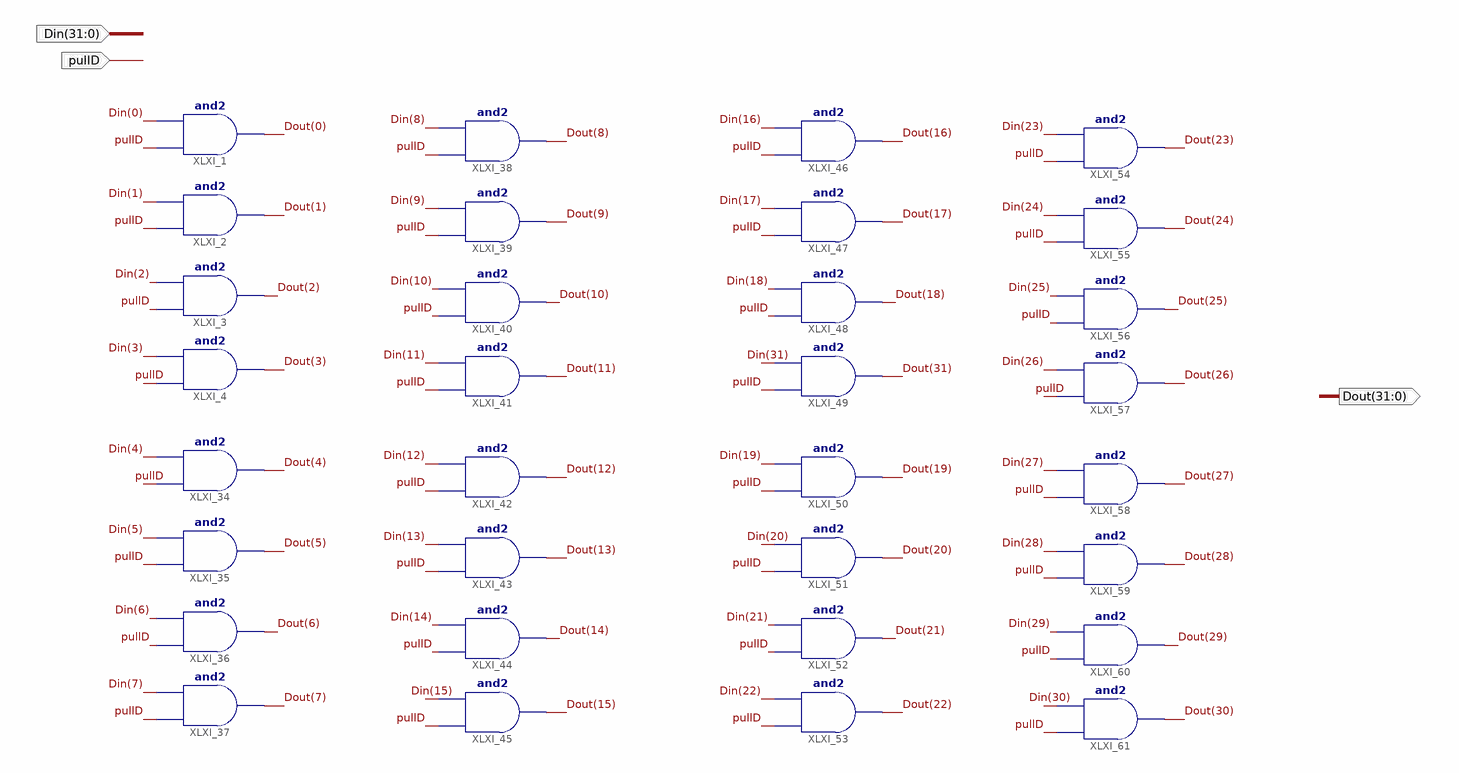
[diagram p0: schematic sheet 1]
// Xilinx ISE schematic And32with1.sch (spartan6) as structural Verilog: 32 symbols, 3 ports
module And32with1 (
  input  [31:0] Din,
  input  pullD,
  output [31:0] Dout
);

  and XLXI_1 (Dout[0], pullD, Din[0]);
  and XLXI_2 (Dout[1], pullD, Din[1]);
  and XLXI_3 (Dout[2], pullD, Din[2]);
  and XLXI_4 (Dout[3], pullD, Din[3]);
  and XLXI_34 (Dout[4], pullD, Din[4]);
  and XLXI_35 (Dout[5], pullD, Din[5]);
  and XLXI_36 (Dout[6], pullD, Din[6]);
  and XLXI_37 (Dout[7], pullD, Din[7]);
  and XLXI_38 (Dout[8], pullD, Din[8]);
  and XLXI_39 (Dout[9], pullD, Din[9]);
  and XLXI_40 (Dout[10], pullD, Din[10]);
  and XLXI_41 (Dout[11], pullD, Din[11]);
  and XLXI_42 (Dout[12], pullD, Din[12]);
  and XLXI_43 (Dout[13], pullD, Din[13]);
  and XLXI_44 (Dout[14], pullD, Din[14]);
  and XLXI_45 (Dout[15], pullD, Din[15]);
  and XLXI_46 (Dout[16], pullD, Din[16]);
  and XLXI_47 (Dout[17], pullD, Din[17]);
  and XLXI_48 (Dout[18], pullD, Din[18]);
  and XLXI_49 (Dout[31], pullD, Din[31]);
  and XLXI_50 (Dout[19], pullD, Din[19]);
  and XLXI_51 (Dout[20], pullD, Din[20]);
  and XLXI_52 (Dout[21], pullD, Din[21]);
  and XLXI_53 (Dout[22], pullD, Din[22]);
  and XLXI_54 (Dout[23], pullD, Din[23]);
  and XLXI_55 (Dout[24], pullD, Din[24]);
  and XLXI_56 (Dout[25], pullD, Din[25]);
  and XLXI_57 (Dout[26], pullD, Din[26]);
  and XLXI_58 (Dout[27], pullD, Din[27]);
  and XLXI_59 (Dout[28], pullD, Din[28]);
  and XLXI_60 (Dout[29], pullD, Din[29]);
  and XLXI_61 (Dout[30], pullD, Din[30]);
endmodule
